# EAGLE design IR_linebot4 (EAGLE 5.06)
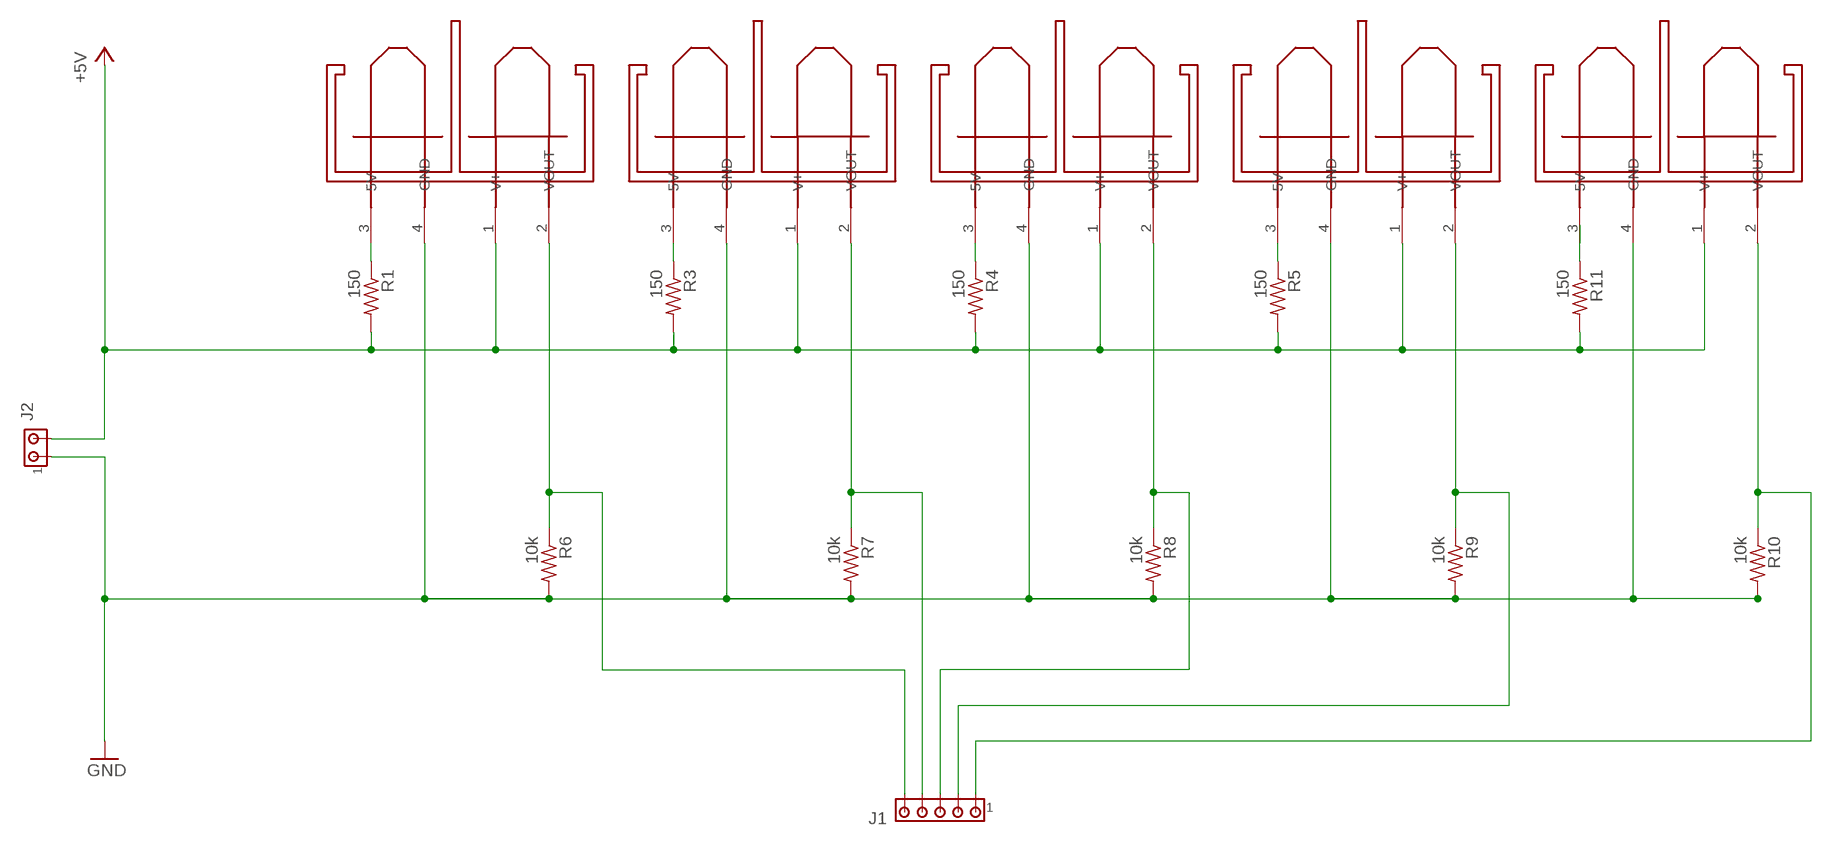
[diagram p0: schematic, sheet 1]

## Parts
IR1  IR_PAIR1  [IR_1]
IR2  IR_PAIR1  [IR_1]
IR3  IR_PAIR1  [IR_1]
IR4  IR_PAIR1  [IR_1]
IR5  IR_PAIR1  [IR_1]
J1  MTA05-100  [10X05MTA]
J2  MTA02-100  [10X02MTA]
R1  150  R-US_0204/7  [0204/7]
R3  150  R-US_0204/7  [0204/7]
R4  150  R-US_0204/7  [0204/7]
R5  150  R-US_0204/7  [0204/7]
R6  10k  R-US_0204/7  [0204/7]
R7  10k  R-US_0204/7  [0204/7]
R8  10k  R-US_0204/7  [0204/7]
R9  10k  R-US_0204/7  [0204/7]
R10  10k  R-US_0204/7  [0204/7]
R11  150  R-US_0204/7  [0204/7]

## Nets
+5V: IR1.1(V+) IR2.1(V+) IR3.1(V+) IR4.1(V+) IR5.1(V+) J2.2 R1.2 R3.2 R4.2 R5.2 R11.2
A0: IR1.2(VOUT) J1.5 R6.1
A1: IR2.2(VOUT) J1.4 R7.1
A2: IR3.2(VOUT) J1.3 R8.1
A3: IR4.2(VOUT) J1.2 R9.1
A4: IR5.2(VOUT) J1.1 R10.1
GND: IR1.4(GND) IR2.4(GND) IR3.4(GND) IR4.4(GND) IR5.4(GND) J2.1 R6.2 R7.2 R8.2 R9.2 R10.2
N$1: IR1.3(5V) R1.1
N$2: IR2.3(5V) R3.1
N$3: IR3.3(5V) R4.1
N$4: IR4.3(5V) R5.1
N$5: R11.1
Unconnected: IR5.3(5V)

## Library data of the parts
IR1-IR5 = A-JD3:IR_PAIR1
J1 = con-amp:MTA05-100: AMP connector
J2 = con-amp:MTA02-100: AMP connector
R1 R3-R11 = resistor:R-US_: RESISTOR, American symbol

## Board
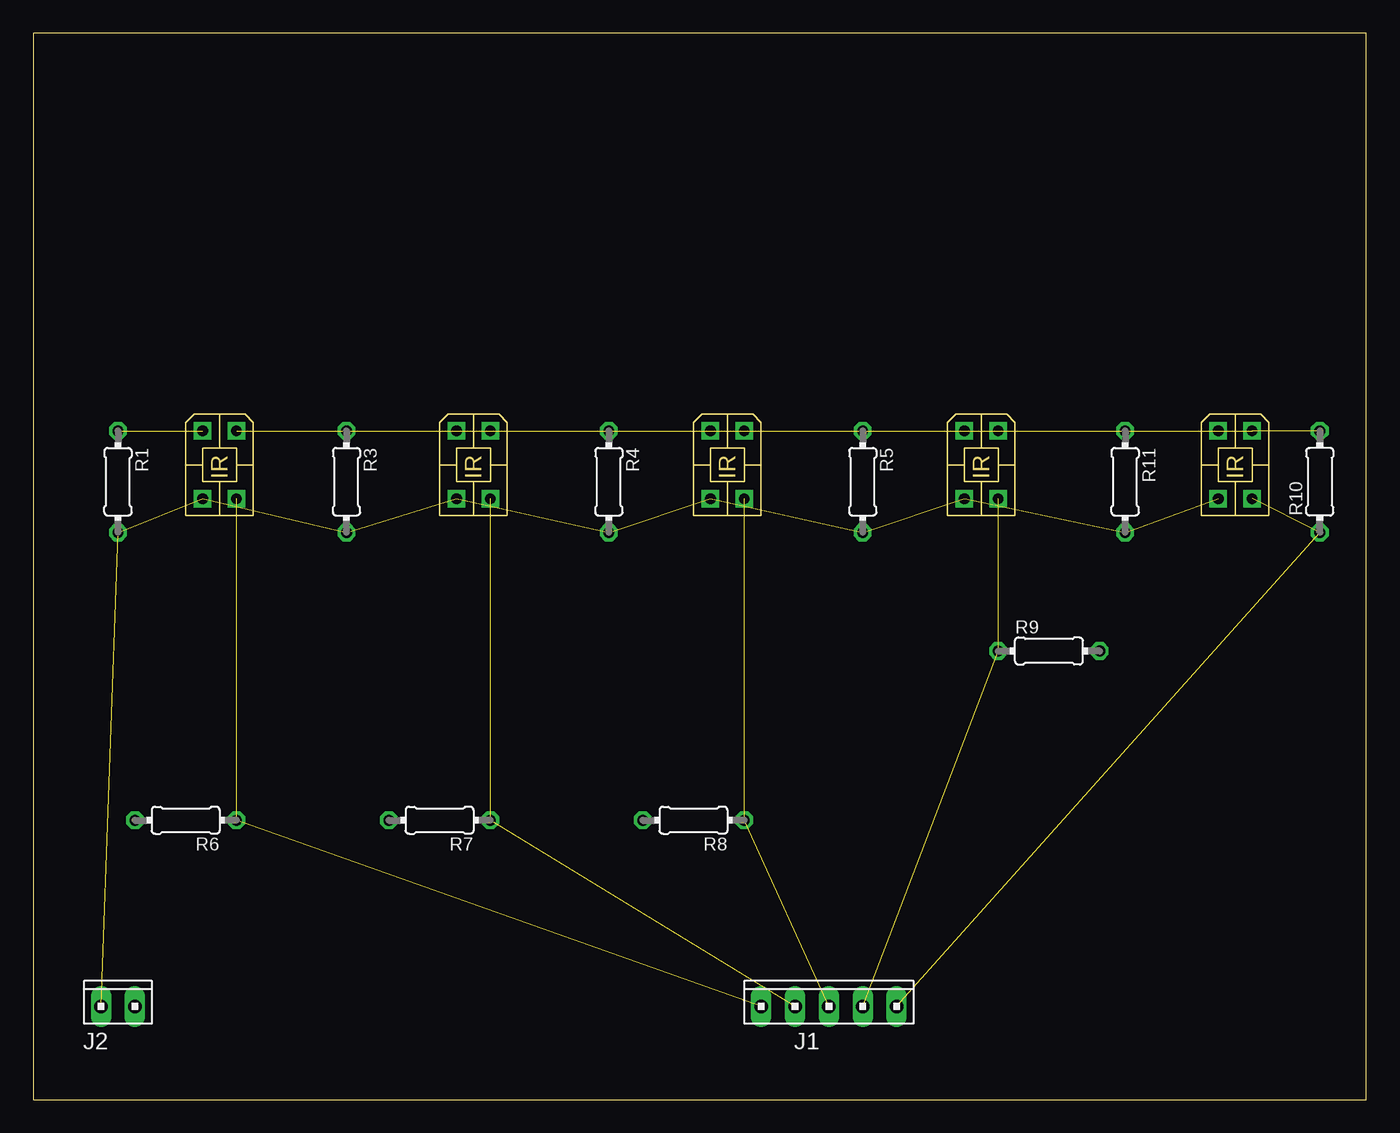
[diagram p1: board, top side]
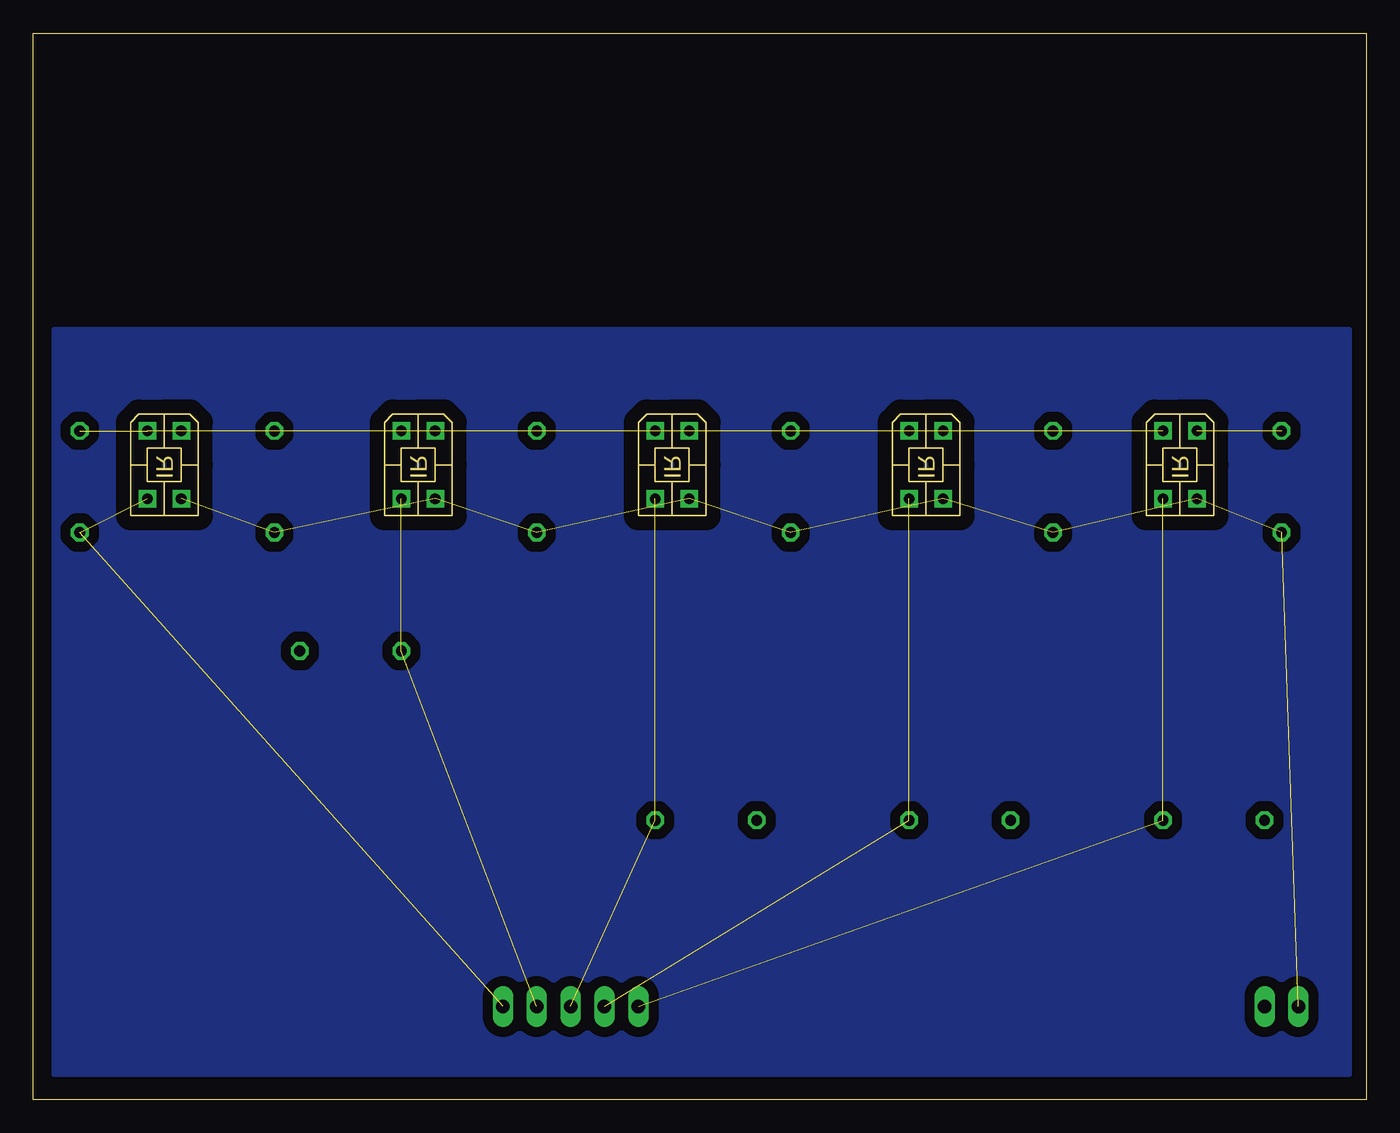
[diagram p2: board, bottom side, seen from below]

Size 100 x 80 mm. Coordinates in mm from the lower left corner, seen from the top.
Outline: 0,0 100,0 100,80 0,80 0,0
Copper layers (1*16): Top 0.035mm / dielectric 1.5mm / Bottom 0.035mm
Design rules "default *": minimum track width 10mil, minimum drill 24mil, track to track 30mil, track to pad 30mil, pad to pad 8mil, via to via 8mil, smd to smd 8mil, copper to edge 40mil, drill to drill 8mil, minimum pad ring 10mil, minimum via ring 8mil, stop-mask expansion 4mil, vias tented up to drill 0mil, thermal gap 10mil

### Footprints (pad centres in the part's own frame; a part is rotated, then mirrored left to right if it is on the bottom)
IR_1 = drill 0.8 square: 1 -2.54,1.27; 2 -2.54,-1.27; 3 2.54,1.27; 4 2.54,-1.27
10X05MTA = drill 1.016 long: 1 5.08,0; 2 2.54,0; 3 0,0; 4 -2.54,0; 5 -5.08,0
10X02MTA = drill 1.016 long: 1 1.27,0; 2 -1.27,0
0204/7 = drill 0.813 octagon: 1 -3.81,0; 2 3.81,0

### Placement (x,y rotation side)
IR1  13.97,47.62 90 top
IR2  33.02,47.62 90 top
IR3  52.07,47.62 90 top
IR4  71.12,47.62 90 top
IR5  90.17,47.62 90 top
J1  59.69,6.99 0 top
J2  6.35,6.99 0 top
R1  6.35,46.35 270 top
R3  23.5,46.35 270 top
R4  43.18,46.35 270 top
R5  62.23,46.35 270 top
R6  11.43,20.95 180 top
R7  30.48,20.95 180 top
R8  49.53,20.95 180 top
R9  76.2,33.66 0 top
R10  96.52,46.35 90 top
R11  81.92,46.35 270 top

### Tracks (layer width: path | path; a pad name or v marks a point on that pad's centre or on a via)
+5V  (10 unrouted)
A0  (2 unrouted)
A1  (2 unrouted)
A2  (2 unrouted)
A3  (2 unrouted)
A4  (2 unrouted)
GND  (5 unrouted)
GND2
  pour Bottom: 1.27,57.78 98.42,57.78 98.42,1.91 1.27,1.91
N$1  (1 unrouted)
N$2  (1 unrouted)
N$3  (1 unrouted)
N$4  (1 unrouted)